# Altium project stm32四层板.PrjPcb
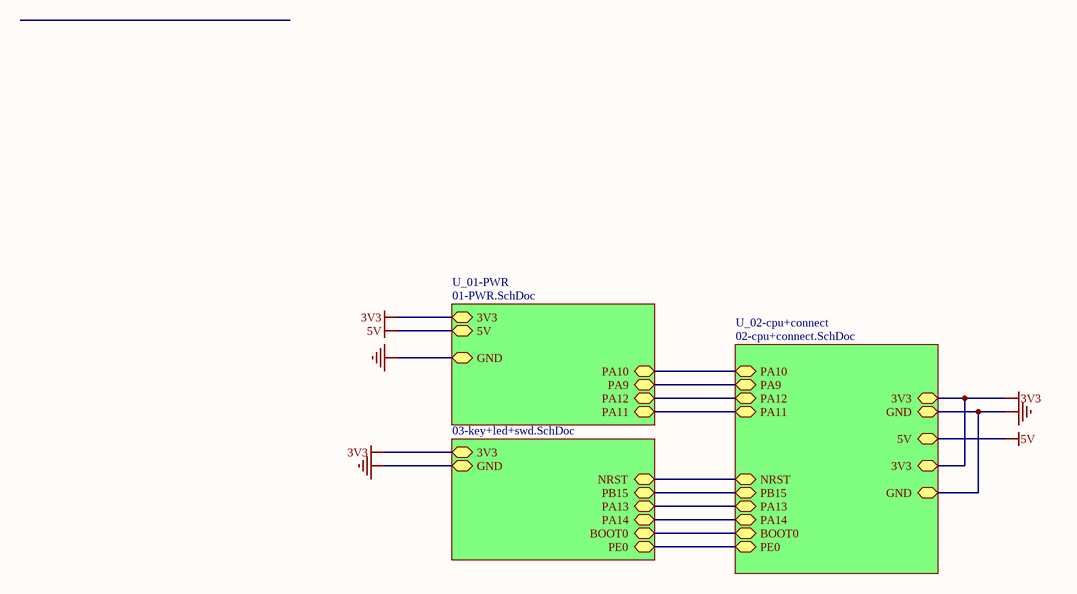
[diagram p0: Main.SchDoc]
4 sheets, 44 parts. Net scope: hierarchical (ports join the sheet entries above them; power ports are global).
Board files: PCB2.PcbDoc, PCB1.PcbDoc, PCB3.PcbDoc
Sheets:
  Main.SchDoc
    U_03-key+led+swd = 03-key+led+swd.SchDoc
    U_01-PWR = 01-PWR.SchDoc
    U_02-cpu+connect = 02-cpu+connect.SchDoc

## Sheet Main.SchDoc
size A4; SheetNumber: 1; SheetTotal: 4

### Sub-sheets
U_01-PWR = 01-PWR.SchDoc: 3V3 (bidir), 5V (bidir), GND (bidir), PA10 (bidir), PA9 (bidir), PA12 (bidir), PA11 (bidir)
U_02-cpu+connect = 02-cpu+connect.SchDoc: 3V3 (bidir), GND (bidir), NRST (bidir), PB15 (bidir), PA13 (bidir), PA14 (bidir), BOOT0 (bidir), PE0 (bidir), 3V3 (bidir), 5V (bidir), GND (bidir), PA10 (bidir), PA9 (bidir), PA12 (bidir), PA11 (bidir)
U_03-key+led+swd = 03-key+led+swd.SchDoc: 3V3 (bidir), GND (bidir), NRST (bidir), PB15 (bidir), PA13 (bidir), PA14 (bidir), BOOT0 (bidir), PE0 (bidir)

### Nets
3V3: sheet U_03-key+led+swd/3V3, sheet U_01-PWR/3V3, sheet U_02-cpu+connect/3V3, sheet U_02-cpu+connect/3V3
5V: sheet U_01-PWR/5V, sheet U_02-cpu+connect/5V
GND: sheet U_03-key+led+swd/GND, sheet U_01-PWR/GND, sheet U_02-cpu+connect/GND, sheet U_02-cpu+connect/GND
BOOT0: sheet U_03-key+led+swd/BOOT0, sheet U_02-cpu+connect/BOOT0
NRST: sheet U_03-key+led+swd/NRST, sheet U_02-cpu+connect/NRST
PA9: sheet U_01-PWR/PA9, sheet U_02-cpu+connect/PA9
PA10: sheet U_01-PWR/PA10, sheet U_02-cpu+connect/PA10
PA11: sheet U_01-PWR/PA11, sheet U_02-cpu+connect/PA11
PA12: sheet U_01-PWR/PA12, sheet U_02-cpu+connect/PA12
PA13: sheet U_03-key+led+swd/PA13, sheet U_02-cpu+connect/PA13
PA14: sheet U_03-key+led+swd/PA14, sheet U_02-cpu+connect/PA14
PB15: sheet U_03-key+led+swd/PB15, sheet U_02-cpu+connect/PB15
PE0: sheet U_03-key+led+swd/PE0, sheet U_02-cpu+connect/PE0

## Sheet 03-key+led+swd.SchDoc
size A4; SheetNumber: 4; SheetTotal: 4
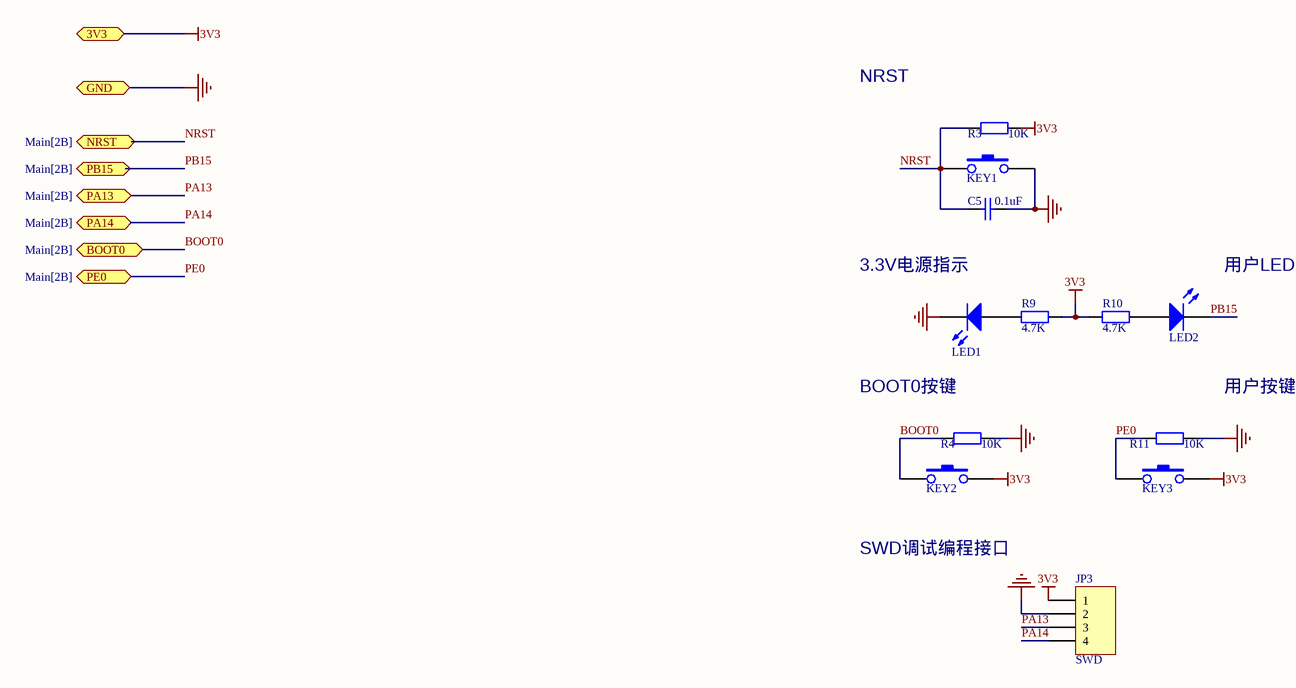
[diagram p1: 03-key+led+swd.SchDoc]

### Parts
C5  0.1uF  [C 0402_L]
JP3  SWD  [HDR2.54-WS-4P]
KEY1  KEY  [SWT3*4]  (value not drawn)
KEY2  KEY  [SWT3*4]  (value not drawn)
KEY3  KEY  [SWT3*4]  (value not drawn)
LED1  LED  [LED 0603]  (value not drawn)
LED2  LED  [LED 0603]  (value not drawn)
R3  10K  [R 0402_L]
R4  10K  [R 0402_L]
R9  4.7K  [R 0402_L]
R10  4.7K  [R 0402_L]
R11  10K  [R 0402_L]

### Ports
3V3 (bidir, see Main[2B]), BOOT0 (bidir, see Main[2B]), GND (bidir, see Main[2B]), NRST (bidir, see Main[2B]), PA13 (bidir, see Main[2B]), PA14 (bidir, see Main[2B]), PB15 (bidir, see Main[2B]), PE0 (bidir, see Main[2B])

### Nets
3V3: JP3.1 KEY2.2 KEY3.2 R3.1 R9.1 R10.1 ; port 3V3
GND: C5.1 JP3.2 KEY1.2 LED1.2(K) R4.1 R11.1 ; port GND
BOOT0: KEY2.1 R4.2 ; port BOOT0
NRST: C5.2 KEY1.1 R3.2 ; port NRST
PA13: JP3.3 ; port PA13
PA14: JP3.4 ; port PA14
PB15: LED2.2(K) ; port PB15
PE0: KEY3.1 R11.2 ; port PE0
NetLED1_1: LED1.1(A) R9.2
NetLED2_1: LED2.1(A) R10.2

### Notes on the sheet
- NRST
- 3.3V电源指示
- 用户LED
- BOOT0按键
- 用户按键
- SWD调试编程接口

### Library data of the parts
C5 = Cap
JP3 = Header 1*4: LatestRevisionDate: 17-Jul-2002; LatestRevisionNote: Re-released for DXP Platform.; Publisher: Altium Limited
R3 R4 R9-R11 = Res

## Sheet 01-PWR.SchDoc
size A4; SheetNumber: 2; SheetTotal: 4
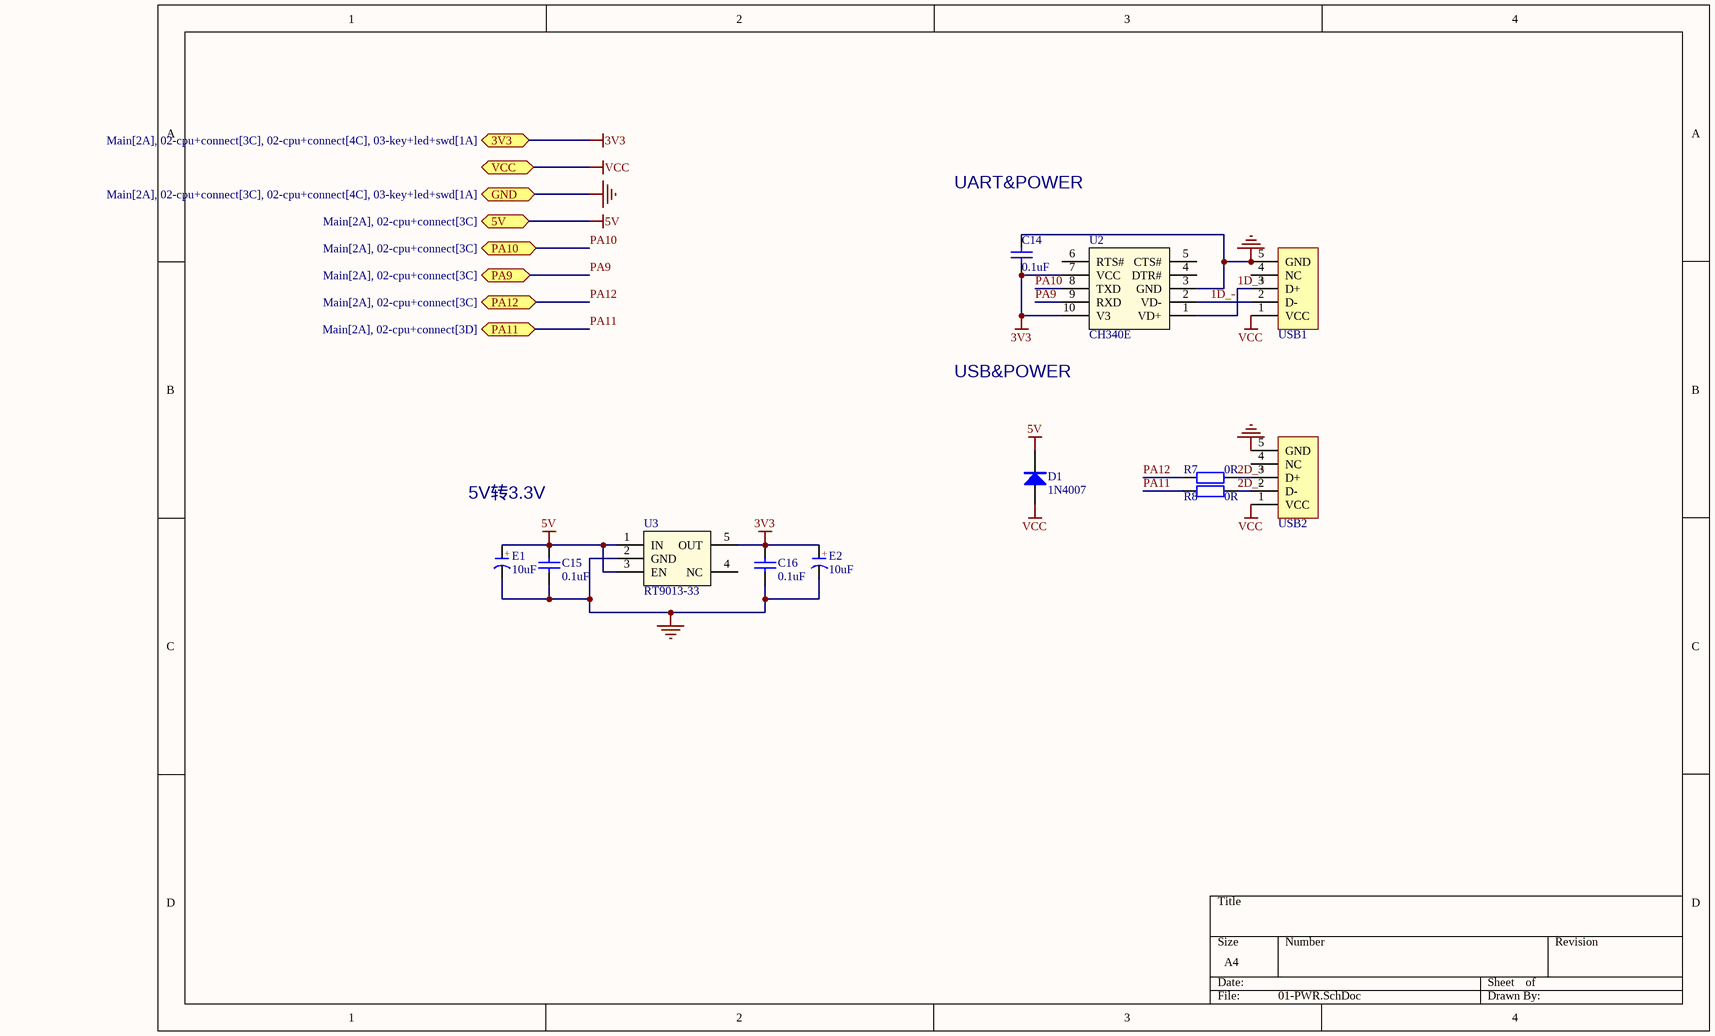
[diagram p2: 01-PWR.SchDoc]

### Parts
C14  0.1uF  [C 0402_L]
C15  0.1uF  [C 0402_L]
C16  0.1uF  [C 0402_L]
D1  1N4007  [SOD-123]
E1  10uF  [CD A(3216)]
E2  10uF  [CD A(3216)]
R7  0R  [R 0402_L]
R8  0R  [R 0402_L]
U2  CH340E  [MSOP10_L]
U3  RT9013-33  [SOT23-5N]
USB1  USB  [USB-MICRO_E]  (value not drawn)
USB2  USB  [USB-MICRO_E]  (value not drawn)

### Ports
3V3 (bidir, see Main[2A], 02-cpu+connect[3C], 02-cpu+connect[4C], 03-key+led+swd[1A]), 5V (bidir, see Main[2A], 02-cpu+connect[3C]), GND (bidir, see Main[2A], 02-cpu+connect[3C], 02-cpu+connect[4C], 03-key+led+swd[1A]), PA9 (bidir, see Main[2A], 02-cpu+connect[3C]), PA10 (bidir, see Main[2A], 02-cpu+connect[3C]), PA11 (bidir, see Main[2A], 02-cpu+connect[3D]), PA12 (bidir, see Main[2A], 02-cpu+connect[3C]), VCC (bidir)

### Nets
3V3: C14.2 C16.2 E2.1(A) U2.7(VCC) U2.10(V3) U3.5(OUT) ; port 3V3
5V: C15.2 D1.2(K) E1.1(A) U3.1(IN) U3.3(EN) ; port 5V
GND: C14.1 C15.1 C16.1 E1.2(K) E2.2(K) U2.3(GND) U3.2(GND) USB1.5(GND) USB2.5(GND) ; port GND
VCC: D1.1(A) USB1.1(VCC) USB2.1(VCC) ; port VCC
1D_+: U2.1(VD+) USB1.3(D+)
1D_-: U2.2(VD-) USB1.2(D-)
2D_+: R7.1 USB2.3(D+)
2D_-: R8.1 USB2.2(D-)
PA9: U2.9(RXD) ; port PA9
PA10: U2.8(TXD) ; port PA10
PA11: R8.2 ; port PA11
PA12: R7.2 ; port PA12

Not connected (* = marked no-connect by the designer): U2 4(DTR#) 5(CTS#) 6(RTS#); U3 4(NC); USB1 4(NC); USB2 4(NC)

### Notes on the sheet
- UART&POWER
- USB&POWER
- 5V转3.3V
- (in symbol C-CD) +

### Library data of the parts
C14-C16 = Cap
D1 = 1N4007: 整流二极管; BOM名称: 整流二极管
E1 E2 = C-CD: 贴片钽电容; BOM名称: 贴片钽电容
R7 R8 = Res

## Sheet 02-cpu+connect.SchDoc
size A4; SheetNumber: 3; SheetTotal: 4
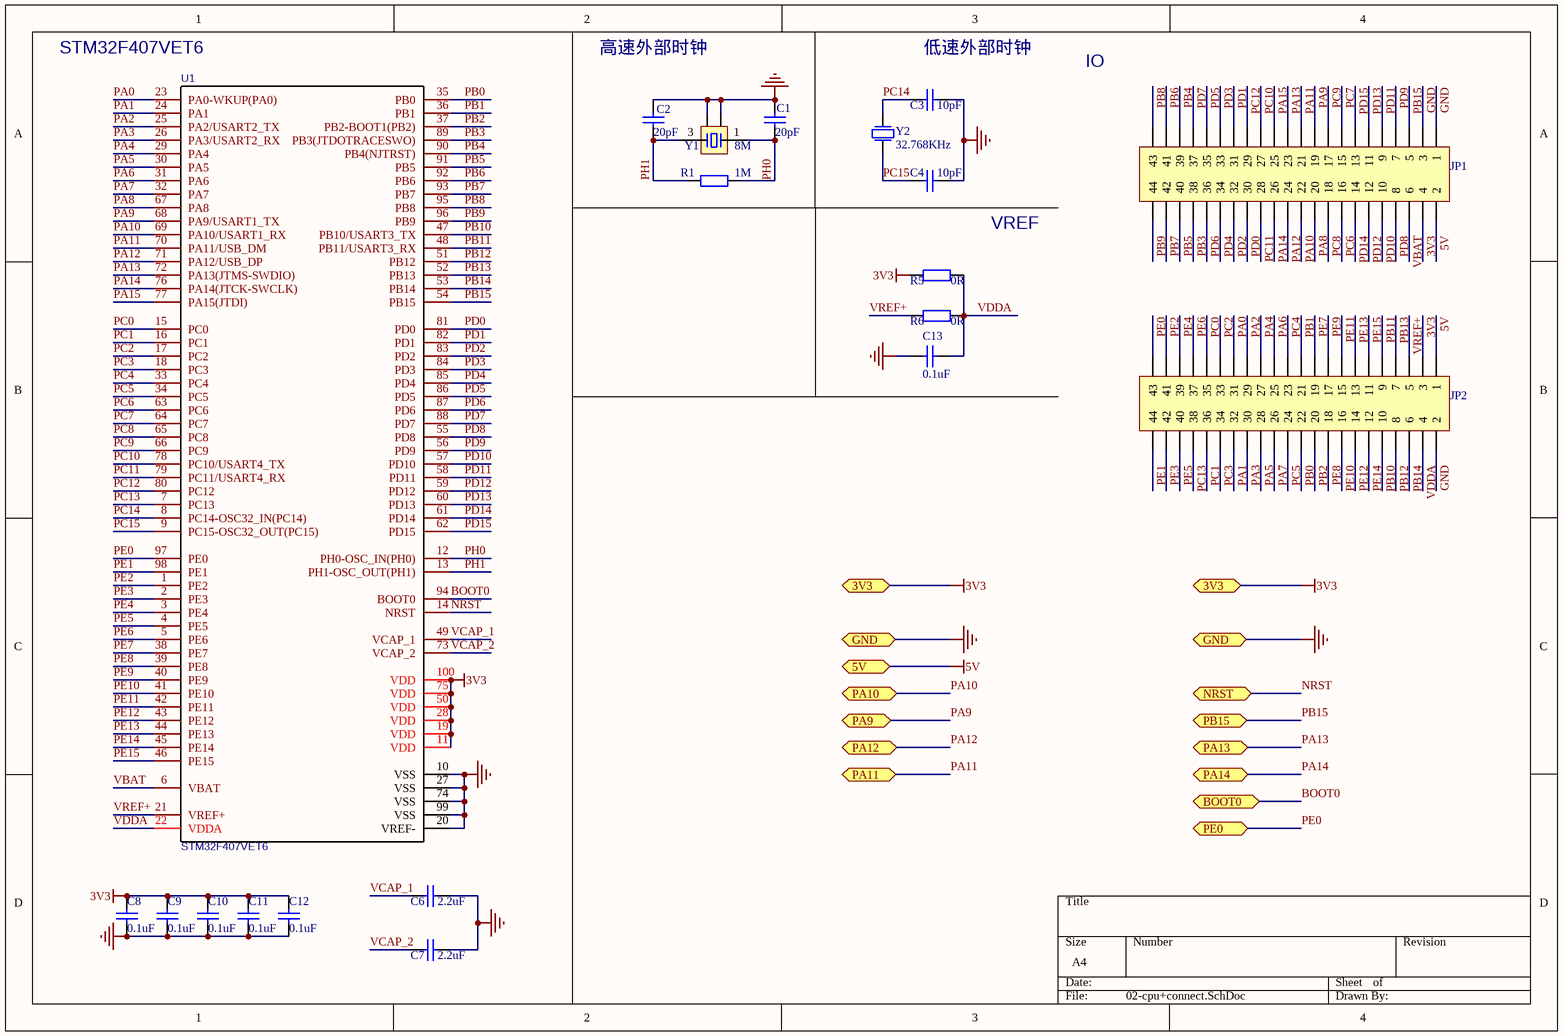
[diagram p3: 02-cpu+connect.SchDoc]

### Parts
C1  20pF  [C 0402_L]
C2  20pF  [C 0402_L]
C3  10pF  [C 0402_L]
C4  10pF  [C 0402_L]
C6  2.2uF  [C 0402_L]
C7  2.2uF  [C 0402_L]
C8  0.1uF  [C 0402_L]
C9  0.1uF  [C 0402_L]
C10  0.1uF  [C 0402_L]
C11  0.1uF  [C 0402_L]
C12  0.1uF  [C 0402_L]
C13  0.1uF  [C 0402_L]
JP1  Header 2x22  [HDR2.54-LI-2x22P]  (value not drawn)
JP2  Header 2x22  [HDR2.54-LI-2x22P]  (value not drawn)
R1  1M  [R 0402_L]
R5  0R  [R 0402_L]
R6  0R  [R 0402_L]
U1  STM32F407VET6  [LQFP100 14x14_N]
Y1  8M  [OSC 3225-4P]
Y2  32.768KHz  [FC135-3.2X1.5]

### Ports
3V3 (bidir, see Main[3A], 01-PWR[1A], 03-key+led+swd[1A]), 5V (bidir, see Main[3B], 01-PWR[1A]), BOOT0 (bidir, see Main[2B], 03-key+led+swd[1B]), GND (bidir, see Main[3A], 03-key+led+swd[1A]), NRST (bidir, see Main[2B], 03-key+led+swd[1B]), PA9 (bidir, see Main[2A], 01-PWR[1B]), PA10 (bidir, see Main[2A], 01-PWR[1A]), PA11 (bidir, see Main[2A], 01-PWR[1B]), PA12 (bidir, see Main[2A], 01-PWR[1B]), PA13 (bidir, see Main[2B], 03-key+led+swd[1B]), PA14 (bidir, see Main[2B], 03-key+led+swd[1B]), PB15 (bidir, see Main[2B], 03-key+led+swd[1B]), PE0 (bidir, see Main[2B], 03-key+led+swd[1B])

### Nets
3V3: C8.1 C9.1 C10.1 C11.1 C12.1 JP1.4 JP2.3 R5.2 U1.11(VDD) U1.19(VDD) U1.28(VDD) U1.50(VDD) U1.75(VDD) U1.100(VDD) ; port 3V3
5V: JP1.2 JP2.1 ; port 5V
GND: C1.1 C2.1 C3.1 C4.1 C6.1 C7.1 C8.2 C9.2 C10.2 C11.2 C12.2 C13.1 JP1.1 JP1.3 JP2.2 U1.10(VSS) U1.20(VREF-) U1.27(VSS) U1.74(VSS) U1.99(VSS) Y1.2 Y1.4 ; port GND
BOOT0: U1.94(BOOT0) ; port BOOT0
NRST: U1.14(NRST) ; port NRST
PA0: JP2.31 U1.23(PA0-WKUP(PA0))
PA1: JP2.32 U1.24(PA1)
PA2: JP2.29 U1.25(PA2/USART2_TX)
PA3: JP2.30 U1.26(PA3/USART2_RX)
PA4: JP2.27 U1.29(PA4)
PA5: JP2.28 U1.30(PA5)
PA6: JP2.25 U1.31(PA6)
PA7: JP2.26 U1.32(PA7)
PA8: JP1.20 U1.67(PA8)
PA9: JP1.19 U1.68(PA9/USART1_TX) ; port PA9
PA10: JP1.22 U1.69(PA10/USART1_RX) ; port PA10
PA11: JP1.21 U1.70(PA11/USB_DM) ; port PA11
PA12: JP1.24 U1.71(PA12/USB_DP) ; port PA12
PA13: JP1.23 U1.72(PA13(JTMS-SWDIO)) ; port PA13
PA14: JP1.26 U1.76(PA14(JTCK-SWCLK)) ; port PA14
PA15: JP1.25 U1.77(PA15(JTDI))
PB0: JP2.22 U1.35(PB0)
PB1: JP2.21 U1.36(PB1)
PB2: JP2.20 U1.37(PB2-BOOT1(PB2))
PB3: JP1.38 U1.89(PB3(JTDOTRACESWO))
PB4: JP1.39 U1.90(PB4(NJTRST))
PB5: JP1.40 U1.91(PB5)
PB6: JP1.41 U1.92(PB6)
PB7: JP1.42 U1.93(PB7)
PB8: JP1.43 U1.95(PB8)
PB9: JP1.44 U1.96(PB9)
PB10: JP2.10 U1.47(PB10/USART3_TX)
PB11: JP2.9 U1.48(PB11/USART3_RX)
PB12: JP2.8 U1.51(PB12)
PB13: JP2.7 U1.52(PB13)
PB14: JP2.6 U1.53(PB14)
PB15: JP1.5 U1.54(PB15) ; port PB15
PC0: JP2.35 U1.15(PC0)
PC1: JP2.36 U1.16(PC1)
PC2: JP2.33 U1.17(PC2)
PC3: JP2.34 U1.18(PC3)
PC4: JP2.23 U1.33(PC4)
PC5: JP2.24 U1.34(PC5)
PC6: JP1.16 U1.63(PC6)
PC7: JP1.15 U1.64(PC7)
PC8: JP1.18 U1.65(PC8)
PC9: JP1.17 U1.66(PC9)
PC10: JP1.27 U1.78(PC10/USART4_TX)
PC11: JP1.28 U1.79(PC11/USART4_RX)
PC12: JP1.29 U1.80(PC12)
PC13: JP2.38 U1.7(PC13)
PC14: C3.2 U1.8(PC14-OSC32_IN(PC14)) Y2.1(P1)
PC15: C4.2 U1.9(PC15-OSC32_OUT(PC15)) Y2.2(P2)
PD0: JP1.30 U1.81(PD0)
PD1: JP1.31 U1.82(PD1)
PD2: JP1.32 U1.83(PD2)
PD3: JP1.33 U1.84(PD3)
PD4: JP1.34 U1.85(PD4)
PD5: JP1.35 U1.86(PD5)
PD6: JP1.36 U1.87(PD6)
PD7: JP1.37 U1.88(PD7)
PD8: JP1.8 U1.55(PD8)
PD9: JP1.7 U1.56(PD9)
PD10: JP1.10 U1.57(PD10)
PD11: JP1.9 U1.58(PD11)
PD12: JP1.12 U1.59(PD12)
PD13: JP1.11 U1.60(PD13)
PD14: JP1.14 U1.61(PD14)
PD15: JP1.13 U1.62(PD15)
PE0: JP2.43 U1.97(PE0) ; port PE0
PE1: JP2.44 U1.98(PE1)
PE2: JP2.41 U1.1(PE2)
PE3: JP2.42 U1.2(PE3)
PE4: JP2.39 U1.3(PE4)
PE5: JP2.40 U1.4(PE5)
PE6: JP2.37 U1.5(PE6)
PE7: JP2.19 U1.38(PE7)
PE8: JP2.18 U1.39(PE8)
PE9: JP2.17 U1.40(PE9)
PE10: JP2.16 U1.41(PE10)
PE11: JP2.15 U1.42(PE11)
PE12: JP2.14 U1.43(PE12)
PE13: JP2.13 U1.44(PE13)
PE14: JP2.12 U1.45(PE14)
PE15: JP2.11 U1.46(PE15)
PH0: C1.2 R1.1 U1.12(PH0-OSC_IN(PH0)) Y1.1
PH1: C2.2 R1.2 U1.13(PH1-OSC_OUT(PH1)) Y1.3
VBAT: JP1.6 U1.6(VBAT)
VCAP_1: C6.2 U1.49(VCAP_1)
VCAP_2: C7.2 U1.73(VCAP_2)
VDDA: C13.2 JP2.4 R5.1 R6.1 U1.22(VDDA)
VREF+: JP2.5 R6.2 U1.21(VREF+)

### Notes on the sheet
- (near U1) STM32F407VET6
- 高速外部时钟
- (near C3) 低速外部时钟
- IO
- VREF

### Library data of the parts
C1-C4 C6-C13 = Cap
JP1 JP2 = Header 2x22: 2x22P接插件; BOM名称: 20*2P接插件
R1 R5 R6 = Res
U1 = STM32F407VET6: BOM_Manufacturer: ST; subpart_no: 1; tags: STM32; BOM_Supplier Part: C28730; BOM_Supplier: LCSC; BOM_Manufacturer Part: STM32F407VET6; image: http://image.lceda.cn/szlcsc/C28730.jpg; spicePre: U; spiceSymbolName: STM32F407VET6
Y1 = XTAL-4P: 4脚无源晶振; 负载电容: CL20pF; BOM名称: 4脚无源晶振
Y2 = XTAL-2P: vaule: 32.768KHz

## Nets that join several sheets
3V3: 03-key+led+swd (6 pins), 01-PWR (6 pins), 02-cpu+connect (14 pins)
5V: 01-PWR (5 pins), 02-cpu+connect (JP1.2 JP2.1)
GND: 03-key+led+swd (6 pins), 01-PWR (9 pins), 02-cpu+connect (22 pins)
BOOT0: 03-key+led+swd (KEY2.1 R4.2), 02-cpu+connect (U1.94)
NRST: 03-key+led+swd (C5.2 KEY1.1 R3.2), 02-cpu+connect (U1.14)
PA9: 01-PWR (U2.9), 02-cpu+connect (JP1.19 U1.68)
PA10: 01-PWR (U2.8), 02-cpu+connect (JP1.22 U1.69)
PA11: 01-PWR (R8.2), 02-cpu+connect (JP1.21 U1.70)
PA12: 01-PWR (R7.2), 02-cpu+connect (JP1.24 U1.71)
PA13: 03-key+led+swd (JP3.3), 02-cpu+connect (JP1.23 U1.72)
PA14: 03-key+led+swd (JP3.4), 02-cpu+connect (JP1.26 U1.76)
PB15: 03-key+led+swd (LED2.2), 02-cpu+connect (JP1.5 U1.54)
PE0: 03-key+led+swd (KEY3.1 R11.2), 02-cpu+connect (JP2.43 U1.97)